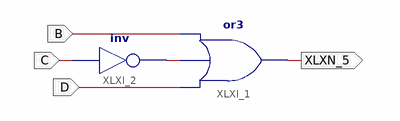
[diagram p0: schematic sheet 1]
// Xilinx ISE schematic bcd_for_c.sch (spartan6) as structural Verilog: 2 symbols, 4 ports
module bcd_for_c (
  input  B,
  input  D,
  input  C,
  output XLXN_5
);

  wire XLXN_1;

  or XLXI_1 (XLXN_5, D, XLXN_1, B);
  not XLXI_2 (XLXN_1, C);
endmodule
